# EAGLE design pl2303 (EAGLE 7.3.0)
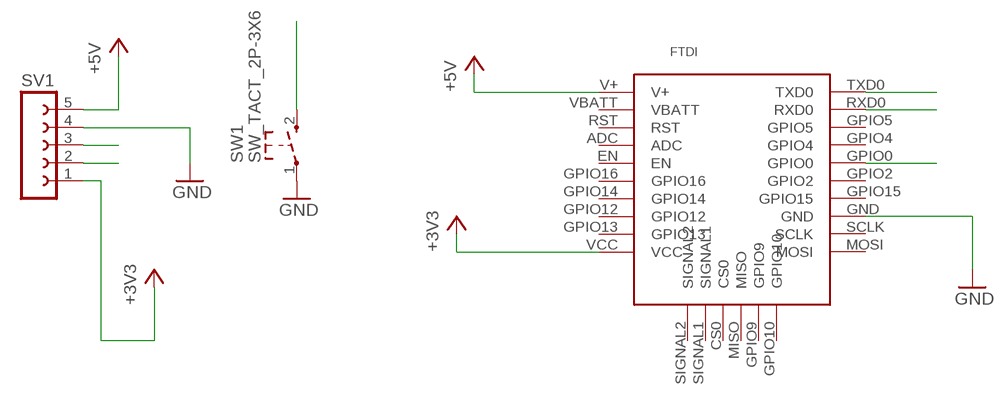
[diagram p0: schematic, sheet 1]

## Parts
FTDI  ESP-BOARD  [ESP-BOARD]
SV1  FE05-1  [FE05-1]
SW1  SW_TACT_2P-3X6  [SW_TACT_3X6]

## Nets
+3V3: FTDI.VCC SV1.1
+5V: FTDI.V+ SV1.5
GND: FTDI.GND SV1.4 SW1.1
GPIO0: FTDI.GPIO0 SW1.2
RXD0: FTDI.RXD0 SV1.2
TXD0: FTDI.TXD0 SV1.3
Unconnected: FTDI.ADC FTDI.CS0 FTDI.EN FTDI.GPIO2 FTDI.GPIO4 FTDI.GPIO5 FTDI.GPIO9 FTDI.GPIO10 FTDI.GPIO12 FTDI.GPIO13 FTDI.GPIO14 FTDI.GPIO15 FTDI.GPIO16 FTDI.MISO FTDI.MOSI FTDI.RST FTDI.SCLK FTDI.SIGNAL1 FTDI.SIGNAL2

## Power pins joined to a net without a drawn wire
VBATT: FTDI.VBATT

## Library data of the parts
FTDI = ESPstack:ESP-BOARD: STANDARIZED ESP-STACK BOARD
SV1 = con-lsta:FE05-1: FEMALE HEADER; OC_FARNELL: unknown; OC_NEWARK: unknown
SW1 = dp_devices:SW_TACT_2P

## Board
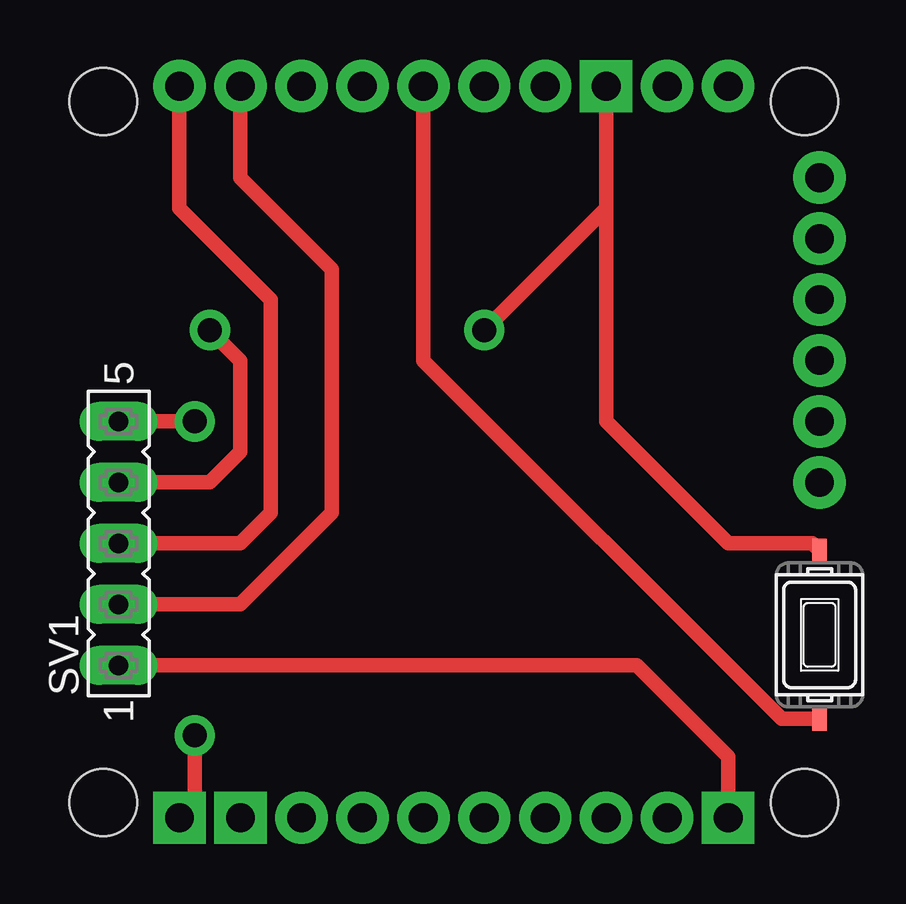
[diagram p1: board, top side]
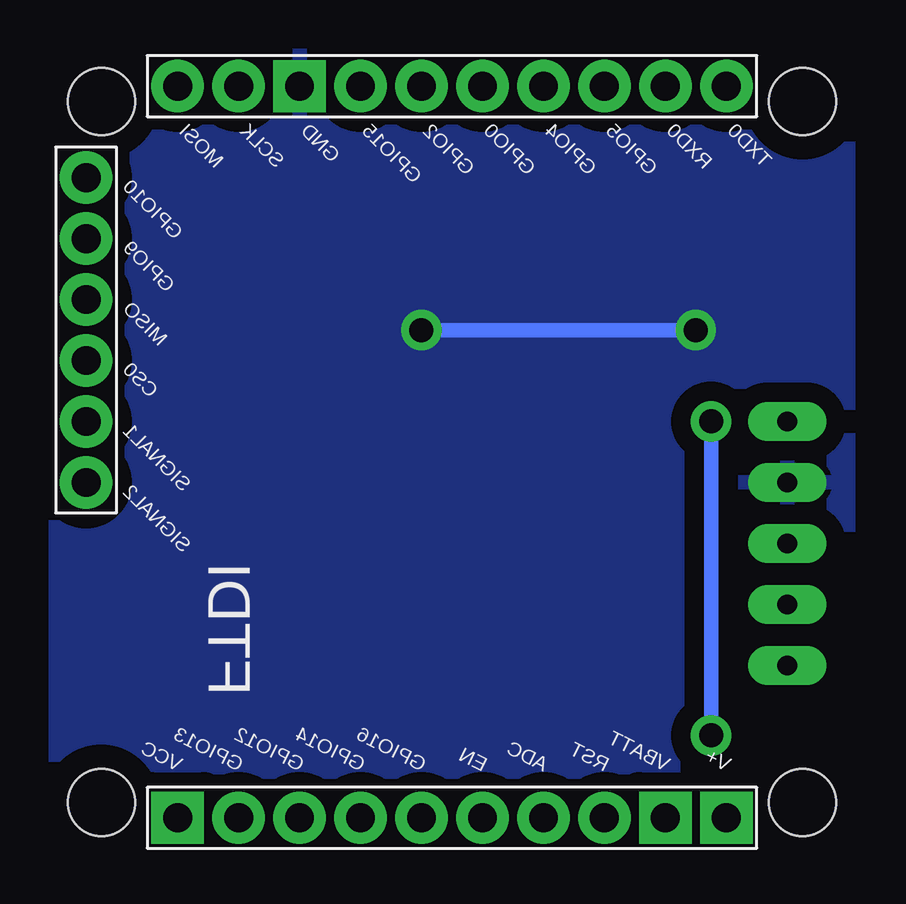
[diagram p2: board, bottom side, seen from below]

No outline drawn. Coordinates in mm, seen from the top.
Copper layers (1*16): Top 0.035mm / dielectric 1.5mm / Bottom 0.035mm
Design rules "default *": minimum track width 10mil, minimum drill 24mil, track to track 8mil, track to pad 8mil, pad to pad 8mil, via to via 8mil, smd to smd 8mil, copper to edge 40mil, drill to drill 8mil, minimum pad ring 16mil, minimum via ring 8mil, stop-mask expansion 4mil, vias tented up to drill 0mil, thermal gap 10mil

### Footprints (pad centres in the part's own frame; a part is rotated, then mirrored left to right if it is on the bottom)
ESP-BOARD = drill 1.2 pad 2.184: ADC -10.16,-16.51; CS0 8.89,2.54; EN -7.62,-16.51; GPIO0 -7.62,13.97; GPIO2 -5.08,13.97; GPIO4 -10.16,13.97; GPIO5 -12.7,13.97; GPIO9 8.89,7.62; GPIO10 8.89,10.16; GPIO12 0,-16.51; GPIO13 2.54,-16.51; GPIO14 -2.54,-16.51; GPIO15 -2.54,13.97; GPIO16 -5.08,-16.51; MISO 8.89,5.08; MOSI 5.08,13.97; RST -12.7,-16.51; RXD0 -15.24,13.97; SCLK 2.54,13.97; SIGNAL1 8.89,0; SIGNAL2 8.89,-2.54; TXD0 -17.78,13.97 | drill 1.2 pad 2.184 square: GND 0,13.97; V+ -17.78,-16.51; VBATT -15.24,-16.51; VCC 5.08,-16.51 | hole 2.8: 8.255,13.335; -20.955,13.335; 8.255,-15.875; -20.955,-15.875
FE05-1 = drill 0.813 long: 1 -5.08,0; 2 -2.54,0; 3 0,0; 4 2.54,0; 5 5.08,0
SW_TACT_3X6 = smd 1 x 0.6: 1 -3.5,0; 2 3.5,0

### Placement (x,y rotation side)
FTDI  24.13,19.05 0 top
SV1  3.81,13.97 90 top
SW1  33.02,10.16 270 top

### Tracks (layer width: path | path; a pad name or v marks a point on that pad's centre or on a via)
+3V3
  Top 0.61: SV1.1 25.4,8.89 29.21,5.08 FTDI.VCC
+5V  (via drill 1 pad 1.68)
  Top 0.61: SV1.5 v6.99,19.05 | v6.99,5.97 6.99,3.17 FTDI.V+
  Bottom 0.61: v6.99,19.05 v6.99,5.97
GND  (via drill 1 pad 1.68)
  Top 0.61: SV1.4 7.62,16.51 8.89,17.78 8.89,21.59 v7.62,22.86 | v19.05,22.86 24.13,27.94 FTDI.GND 24.13,19.05 29.21,13.97 32.71,13.97 SW1.1
  Bottom 0.61: v7.62,22.86 v19.05,22.86
  pour Bottom (isolate 0.813): 1.27,34.29 34.29,34.29 34.29,1.27 1.27,1.27
GPIO0
  Top 0.61: SW1.2 31.44,6.66 16.51,21.59 FTDI.GPIO0
RXD0
  Top 0.61: SV1.2 8.89,11.43 12.7,15.24 12.7,25.4 8.89,29.21 FTDI.RXD0
TXD0
  Top 0.61: SV1.3 8.89,13.97 10.16,15.24 10.16,24.13 6.35,27.94 FTDI.TXD0